# EAGLE schematic chart (EAGLE 7.6.0)
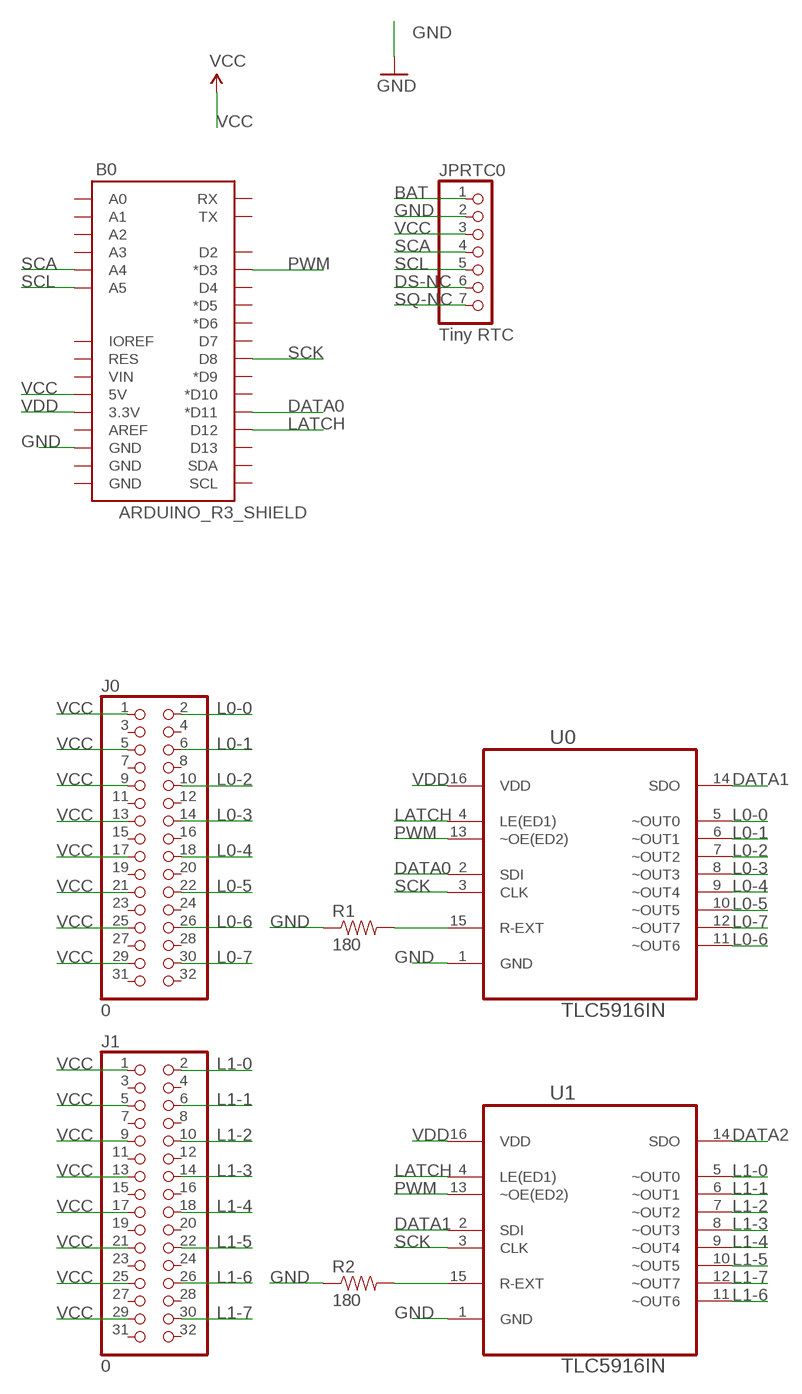
[diagram p0: schematic, sheet 1]

## Parts
B0  ARDUINO_R3_SHIELD  [UNO_R3_SHIELD]
J0  0  PINHD-2X16  [2X16]
J1  0  PINHD-2X16  [2X16]
JPRTC0  Tiny RTC  PINHD-1X7  [1X07]
R1  180  RESISTORPTH-1/4W  [AXIAL-0.4]
R2  180  RESISTORPTH-1/4W  [AXIAL-0.4]
U0  TLC5916IN  [DIP254P762X508-16]
U1  TLC5916IN  [DIP254P762X508-16]

## Nets
BAT: JPRTC0.1
DATA0: B0.D11(*D11) U0.2(SDI)
DATA1: U0.14(SDO) U1.2(SDI)
DATA2: U1.14(SDO)
DS-NC: JPRTC0.6
GND: B0.GND@2(GND) JPRTC0.2 R1.P$1 R2.P$1 U0.1(GND) U1.1(GND)
L0-0: J0.2 U0.5(~OUT0)
L0-1: J0.6 U0.6(~OUT1)
L0-2: J0.10 U0.7(~OUT2)
L0-3: J0.14 U0.8(~OUT3)
L0-4: J0.18 U0.9(~OUT4)
L0-5: J0.22 U0.10(~OUT5)
L0-6: J0.26 U0.11(~OUT6)
L0-7: J0.30 U0.12(~OUT7)
L1-0: J1.2 U1.5(~OUT0)
L1-1: J1.6 U1.6(~OUT1)
L1-2: J1.10 U1.7(~OUT2)
L1-3: J1.14 U1.8(~OUT3)
L1-4: J1.18 U1.9(~OUT4)
L1-5: J1.22 U1.10(~OUT5)
L1-6: J1.26 U1.11(~OUT6)
L1-7: J1.30 U1.12(~OUT7)
LATCH: B0.D12 U0.4(LE(ED1)) U1.4(LE(ED1))
N$1: R2.P$2 U1.15(R-EXT)
N$6: R1.P$2 U0.15(R-EXT)
PWM: B0.D3(*D3) U0.13(~OE(ED2)) U1.13(~OE(ED2))
SCA: B0.A4 JPRTC0.4
SCK: B0.D8 U0.3(CLK) U1.3(CLK)
SCL: B0.A5 JPRTC0.5
SQ-NC: JPRTC0.7
VCC: B0.5V J0.1 J0.5 J0.9 J0.13 J0.17 J0.21 J0.25 J0.29 J1.1 J1.5 J1.9 J1.13 J1.17 J1.21 J1.25 J1.29 JPRTC0.3
VDD: B0.3.3V U0.16(VDD) U1.16(VDD)
Unconnected: B0.A0 B0.A1 B0.A2 B0.A3 B0.AREF B0.D2 B0.D4 B0.D5(*D5) B0.D6(*D6) B0.D7 B0.D9(*D9) B0.D10(*D10) B0.D13 B0.GND@0(GND) B0.GND@1(GND) B0.IOREF B0.RES B0.RX B0.SCL B0.SDA B0.TX B0.VIN J0.3 J0.4 J0.7 J0.8 J0.11 J0.12 J0.15 J0.16 J0.19 J0.20 J0.23 J0.24 J0.27 J0.28 J0.31 J0.32 J1.3 J1.4 J1.7 J1.8 J1.11 J1.12 J1.15 J1.16 J1.19 J1.20 J1.23 J1.24 J1.27 J1.28 J1.31 J1.32

## Library data of the parts
B0 = SparkFun-Boards:ARDUINO_R3_SHIELD: Shield form compatible with the Arduino Uno R3.
J0 J1 = pinhead:PINHD-2X16: PIN HEADER
JPRTC0 = pinhead:PINHD-1X7: PIN HEADER
R1 R2 = SparkFun-Resistors:RESISTOR: Resistor Basic schematic elements and footprints for 0603, 1206, and PTH resistors.
U0 U1 = Texas Instruments_By_element14_Batch_1:TLC5916IN: 8-CHANNEL CONSTANT-CURRENT LED SINK DRIVERS; MPN: TLC5916IN; OC_FARNELL: 1647814; OC_NEWARK: 60M1749; PACKAGE: PDIP-16; SUPPLIER: Texas Instruments